# EAGLE schematic BRUTUS CONTOL BOARD (EAGLE 6.4)
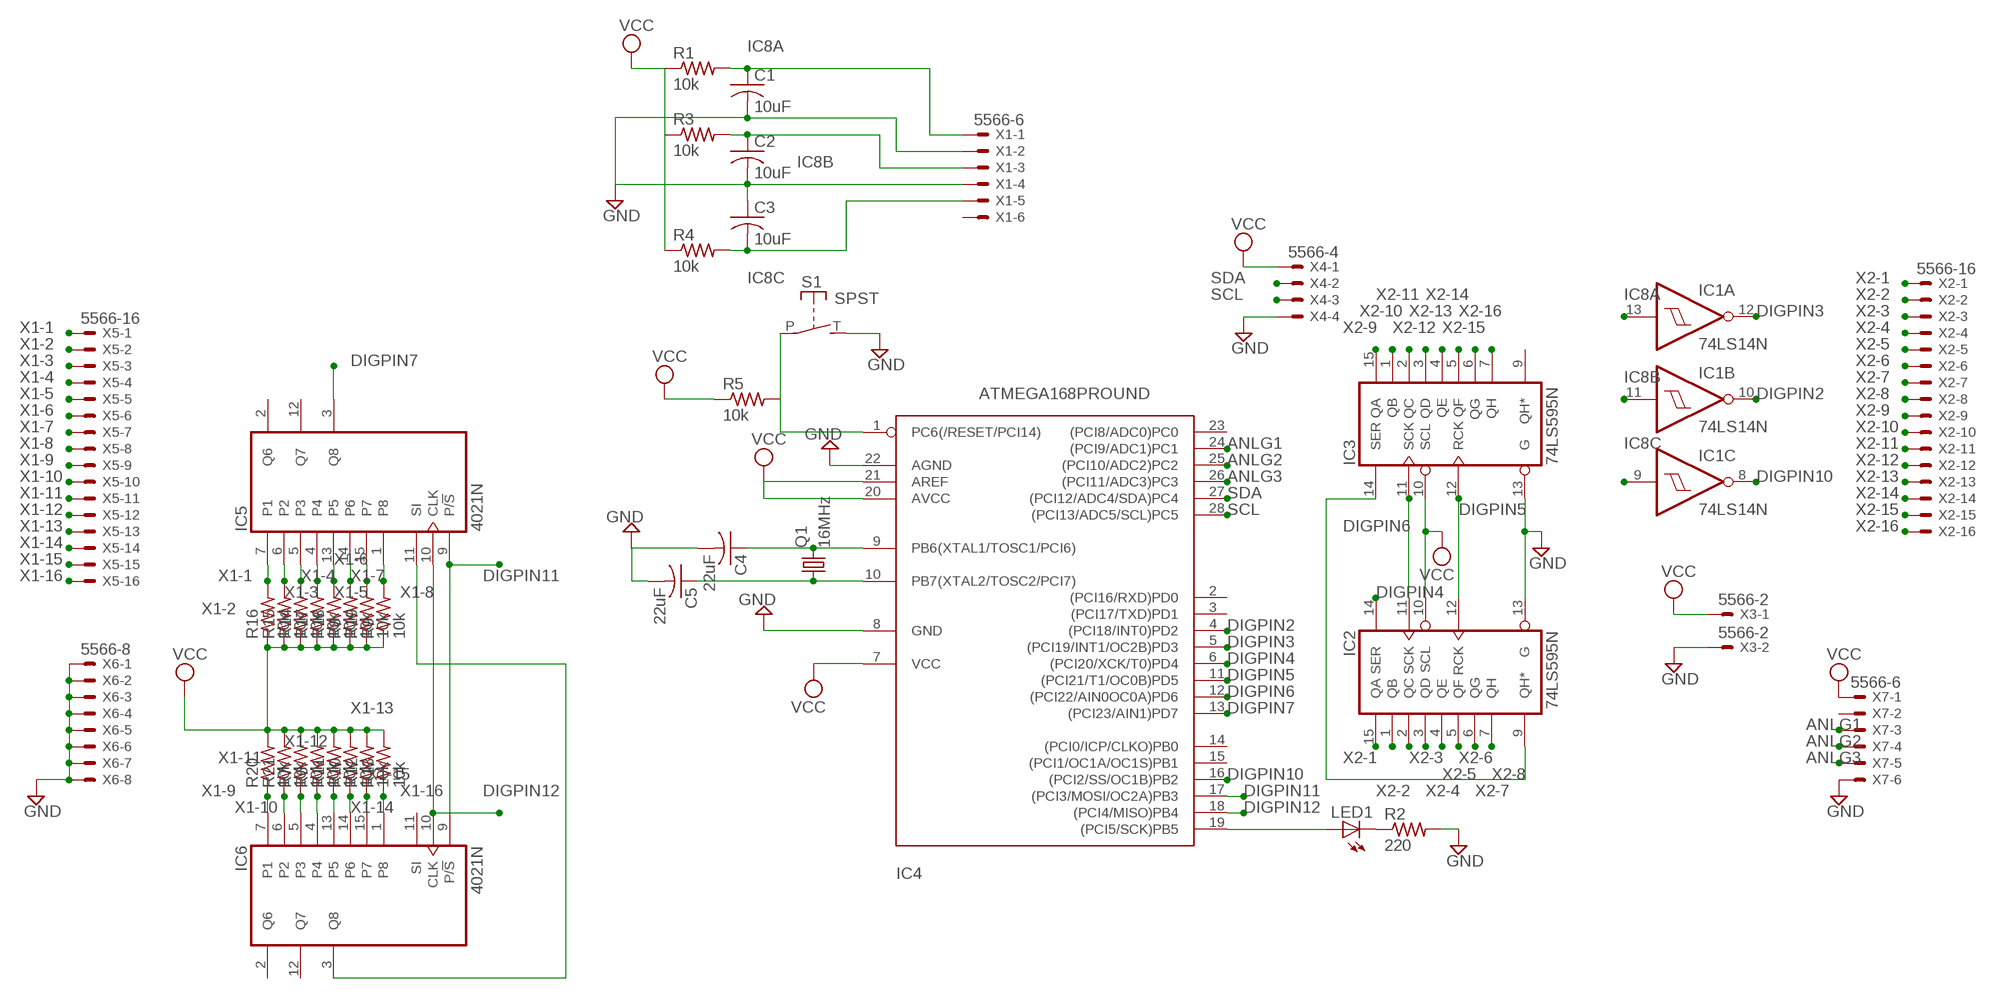
[diagram p0: schematic, sheet 1]

## Parts
C1  10uF  C-US025-025X050  [C025-025X050]
C2  10uF  C-US025-025X050  [C025-025X050]
C3  10uF  C-US025-025X050  [C025-025X050]
C4  22uF  C-US025-025X050  [C025-025X050]
C5  22uF  C-US025-025X050  [C025-025X050]
IC1  74LS14N  [DIL14]
IC2  74LS595N  [DIL16]
IC3  74LS595N  [DIL16]
IC4  ATMEGA168PROUND  [DIL28-3-ROUND]
IC5  4021N  [DIL16]
IC6  4021N  [DIL16]
LED1  LED5MM  [LED5MM]
Q1  16MHz  CRYSTALHC49S  [HC49/S]
R1  10k  R-US_0204/2V  [0204V]
R2  220  R-US_0204/2V  [0204V]
R3  10k  R-US_0204/2V  [0204V]
R4  10k  R-US_0204/2V  [0204V]
R5  10k  R-US_0204/2V  [0204V]
R6  10k  R-US_0204/2V  [0204V]
R7  10k  R-US_0204/2V  [0204V]
R8  10k  R-US_0204/2V  [0204V]
R9  10k  R-US_0204/2V  [0204V]
R10  10k  R-US_0204/2V  [0204V]
R11  10k  R-US_0204/2V  [0204V]
R12  10k  R-US_0204/2V  [0204V]
R13  10k  R-US_0204/2V  [0204V]
R14  10k  R-US_0204/2V  [0204V]
R15  10k  R-US_0204/2V  [0204V]
R16  10k  R-US_0204/2V  [0204V]
R17  10k  R-US_0204/2V  [0204V]
R18  10k  R-US_0204/2V  [0204V]
R19  10k  R-US_0204/2V  [0204V]
R20  10k  R-US_0204/2V  [0204V]
R21  10k  R-US_0204/2V  [0204V]
S1  SPST  [JUDCOSPST]
X1  5566-6  [5566-6]
X2  5566-16  [5566-16]
X3  5566-2  [5566-2]
X4  5566-4  [5566-4]
X5  5566-16  [5566-16]
X6  5566-8  [5566-8]
X7  5566-6  [5566-6]

## Nets
ANLG1: IC4.24((PCI9/ADC1)PC1) X7.3
ANLG2: IC4.25((PCI10/ADC2)PC2) X7.4
ANLG3: IC4.26((PCI11/ADC3)PC3) X7.5
DIGPIN2: IC1.10(B:O) IC4.4((PCI18/INT0)PD2)
DIGPIN3: IC1.12(A:O) IC4.5((PCI19/INT1/OC2B)PD3)
DIGPIN4: IC2.14(SER) IC4.6((PCI20/XCK/T0)PD4)
DIGPIN5: IC2.12(RCK) IC3.12(RCK) IC4.11((PCI21/T1/OC0B)PD5)
DIGPIN6: IC2.11(SCK) IC3.11(SCK) IC4.12((PCI22/AIN0OC0A)PD6)
DIGPIN7: IC4.13((PCI23/AIN1)PD7) IC5.3(Q8)
DIGPIN10: IC1.8(C:O) IC4.16((PCI2/SS/OC1B)PB2)
DIGPIN11: IC4.17((PCI3/MOSI/OC2A)PB3) IC5.9(P/!S) IC6.9(P/!S)
DIGPIN12: IC4.18((PCI4/MISO)PB4) IC5.10(CLK) IC6.10(CLK)
GND: C1.2 C2.2 C3.1 C4.2 C5.2 IC2.13(G) IC3.13(G) IC4.8(GND) IC4.22(AGND) R2.2 S1.T(S) X1.2 X1.4 X3.2 X4.4 X6.1 X6.2 X6.3 X6.4 X6.5 X6.6 X6.7 X6.8 X7.6
IC8A: C1.1 IC1.13(A:I) R1.2 X1.1
IC8B: C2.1 IC1.11(B:I) R3.2 X1.3
IC8C: C3.2 IC1.9(C:I) R4.2 X1.5
N$1: C4.1 IC4.9(PB6(XTAL1/TOSC1/PCI6)) Q1.2
N$2: C5.1 IC4.10(PB7(XTAL2/TOSC2/PCI7)) Q1.1
N$3: IC4.1(PC6(/RESET/PCI14)) R5.2 S1.P
N$5: IC4.19((PCI5/SCK)PB5) LED1.A
N$6: LED1.K(C) R2.1
N$7: IC2.9(QH*) IC3.14(SER)
N$17: IC5.11(SI) IC6.3(Q8)
SCL: IC4.28((PCI13/ADC5/SCL)PC5) X4.3
SDA: IC4.27((PCI12/ADC4/SDA)PC4) X4.2
VCC: IC3.10(SCL) IC4.7(VCC) IC4.20(AVCC) IC4.21(AREF) R1.1 R4.1 R5.1 R6.2 R7.2 R8.1 R9.1 R10.2 R11.2 R12.2 R13.2 R14.1 R15.1 R16.1 R17.1 R18.1 R19.1 R20.2 R21.2 X3.1 X4.1 X7.1
X1-1: IC5.7(P1) R16.2 X5.1
X1-2: IC5.6(P2) R15.2 X5.2
X1-3: IC5.5(P3) R14.2 X5.3
X1-4: IC5.4 R17.2 X5.4
X1-5: IC5.13(P5) R18.2 X5.5
X1-6: IC5.14(P6) R8.2 X5.6
X1-7: IC5.15(P7) R19.2 X5.7
X1-8: IC5.1(P8) R9.2 X5.8
X1-9: IC6.7(P1) R20.1 X5.9
X1-10: IC6.6(P2) R21.1 X5.10
X1-11: IC6.5(P3) R7.1 X5.11
X1-12: IC6.4 R6.1 X5.12
X1-13: R11.1 X5.13
X1-14: IC6.14(P6) R10.1 X5.14
X1-15: IC6.15(P7) R12.1 X5.15
X1-16: IC6.1(P8) R13.1 X5.16
X2-1: IC2.15(QA) X2.1
X2-2: IC2.1(QB) X2.2
X2-3: IC2.2(QC) X2.3
X2-4: IC2.3(QD) X2.4
X2-5: IC2.4(QE) X2.5
X2-6: IC2.5(QF) X2.6
X2-7: IC2.6(QG) X2.7
X2-8: IC2.7(QH) X2.8
X2-9: IC3.15(QA) X2.9
X2-10: IC3.1(QB) X2.10
X2-11: IC3.2(QC) X2.11
X2-12: IC3.3(QD) X2.12
X2-13: IC3.4(QE) X2.13
X2-14: IC3.5(QF) X2.14
X2-15: IC3.6(QG) X2.15
X2-16: IC3.7(QH) X2.16
Unconnected: IC1.1(D:I) IC1.2(D:O) IC1.3(E:I) IC1.4(E:O) IC1.5(F:I) IC1.6(F:O) IC2.10(SCL) IC3.9(QH*) IC4.2((PCI16/RXD)PD0) IC4.3((PCI17/TXD)PD1) IC4.14((PCI0/ICP/CLKO)PB0) IC4.15((PCI1/OC1A/OC1S)PB1) IC4.23((PCI8/ADC0)PC0) IC5.2(Q6) IC5.12(Q7) IC6.2(Q6) IC6.11(SI) IC6.12(Q7) IC6.13(P5) R3.1 X1.6 X7.2

## Power pins joined to a net without a drawn wire
GND: IC1.7(P:GND) IC2.8(GND) IC3.8(GND)
VCC: IC1.14(P:VCC) IC2.16(VCC) IC3.16(VCC)
VDD: IC5.16(VDD) IC6.16(VDD)
VSS: IC5.8(VSS) IC6.8(VSS)

## Library data of the parts
C1-C5 = adafruit:C-US: CAPACITOR, American symbol
IC1 = 74xx-us:74*14: Hex schmitt trigger INVERTER
IC2 IC3 = 74xx-us:74*595: 8-bit SHIFT REGISTER, output latch
IC4 = adafruit:ATMEGA168*P: MICROCONTROLLER 16 kBytes FLASH 1 kBytes SRAM 512 Bytes EEPROM USART 8-channel 10 bit ADC
IC5 IC6 = 40xx:4021: 8-bit static SHIFT REGISTER
LED1 = adafruit:LED: LED OSRAM: - CHIPLED LG R971, LG N971, LY N971, LG Q971, LY Q971, LO R971, LY R971 LH N974, LH R974 LS Q976, LO Q976, LY Q976 LO Q996 - Hyper CHIPLED LW Q18S LB Q993, LB Q99A, LB R99A - SideLED LS A670, LO A670, LY A670, LG A670, LP A670 LB A673, LV A673, LT A673, LW A673 LH A674 LY A675 LS A676, LA A676, LO A676, LY A676, LW A676 LS A679, LY A679, LG A679 - Hyper Micro SIDELED® LS Y876, LA Y876, LO Y876, LY Y876 LT Y87S - SmartLED LW L88C, LW L88S LB L89C, LB L89S, LG L890 LS L89K, LO L89K, LY L89K LS L896, LA L896, LO L896, LY L896 - TOPLED LS T670, LO T670, LY T670, LG T670, LP T670 LSG T670, LSP T670, LSY T670, LOP T670, LYG T670 LG T671, LOG T671, LSG T671 LB T673, LV T673, LT T673, LW T673 LH T674 LS T676, LA T676, LO T676, LY T676, LB T676, LH T676, LSB T676, LW T676 LB T67C, LV T67C, LT T67C, LS T67K, LO T67K, LY T67K, LW E67C LS E67B, LA E67B, LO E67B, LY E67B, LB E67C, LV E67C, LT E67C LW T67C LS T679, LY T679, LG T679 LS T770, LO T770, LY T770, LG T770, LP T770 LB T773, LV T773, LT T773, LW T773 LH T774 LS E675, LA E675, LY E675, LS T675 LS T776, LA T776, LO T776, LY T776, LB T776 LHGB T686 LT T68C, LB T68C - Hyper Mini TOPLED® LB M676 - Mini TOPLED Santana® LG M470 LS M47K, LO M47K, LY M47K Source: http://www.osram.convergy.de/
Q1 = adafruit:CRYSTAL: CRYSTAL; OC_FARNELL: 1667008; OC_NEWARK: unknown
R1-R21 = adafruit:R-US_: RESISTOR, American symbol
S1 = adafruit:SPST: Judco 50-0015-00
X1 X7 = con-molex:5566-6: Mini FIT connector 6 pol Source: http://www.molex.com; MPN: 95566-61002; OC_FARNELL: unknown; OC_NEWARK: 22K8620
X2 X5 = con-molex:5566-16: Mini FIT connector 16 pol Source: http://www.molex.com; OC_FARNELL: unknown; OC_NEWARK: unknown
X3 = con-molex:5566-2: Mini FIT connector 2 pol Source: http://www.molex.com; OC_FARNELL: 1822072; OC_NEWARK: unknown
X4 = con-molex:5566-4: Mini FIT connector 4 pol Source: http://www.molex.com; OC_FARNELL: unknown; OC_NEWARK: unknown
X6 = con-molex:5566-8: Mini FIT connector 8 pol Source: http://www.molex.com; OC_FARNELL: unknown; OC_NEWARK: unknown

## Net classes
0 default: width 0.381 mm, drill 0.001 mm, clearance 0.254 mm